# Altium schematic sheet 1V8 Buck.SchDoc
size A
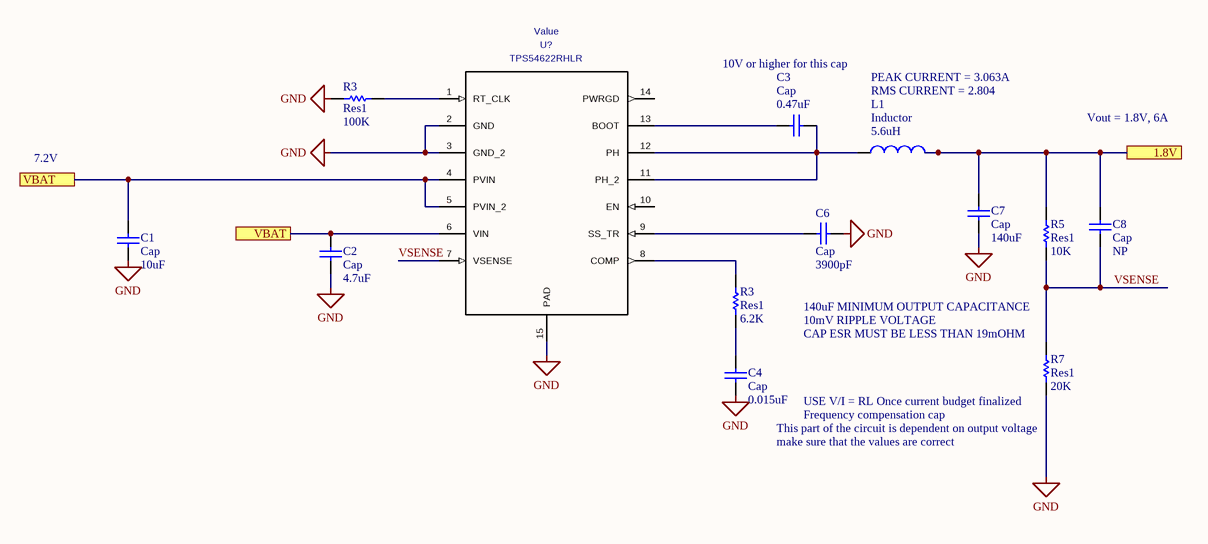
[diagram p0: 1V8 Buck.SchDoc]

## Parts
(Parts that share a designator on the sheet are numbered #1, #2 ... from top to bottom, then left to right.)
C1  Cap  value 10uF  [RAD-0.3]
C2  Cap  value 4.7uF  [RAD-0.3]
C3  Cap  value 0.47uF  [RAD-0.3]
C4  Cap  value 0.015uF  [RAD-0.3]
C6  Cap  value 3900pF  [RAD-0.3]
C7  Cap  value 140uF  [RAD-0.3]
C8  Cap  value NP  [RAD-0.3]
L1  Inductor  value 5.6uH  [0402-A]
R3#1  Res1  value 100K  [AXIAL-0.3]
R3#2  Res1  value 6.2K  [AXIAL-0.3]
R5  Res1  value 10K  [AXIAL-0.3]
R7  Res1  value 20K  [AXIAL-0.3]
U?  TPS54622RHLR  [RHL0014A]

## Ports
1.8V, VBAT

## Nets
GND: C1.1 C2.1 C4.1 C6.1 C7.1 R3#1.1 R7.1 U?.2(GND) U?.3(GND_2) U?.15(PAD)
1.8V: C7.2 C8.2 L1.2 R5.1 ; port 1.8V
VBAT: C1.2 C2.2 U?.4(PVIN) U?.5(PVIN_2) U?.6(VIN) ; port VBAT
VSENSE: C8.1 R5.2 R7.2 U?.7(VSENSE)
NetC3_1: C3.1 U?.13(BOOT)
NetC3_2: C3.2 L1.1 U?.11(PH_2) U?.12(PH)
NetC4_2: C4.2 R3#2.1
NetC6_2: C6.2 U?.9(SS_TR)
NetR3#1_2: R3#1.2 U?.1(RT_CLK)
NetR3#2_2: R3#2.2 U?.8(COMP)

Not connected (* = marked no-connect by the designer): U? 10(EN) 14(PWRGD)

## Notes on the sheet
- 10V or higher for this cap
- PEAK CURRENT = 3.063A
- RMS CURRENT = 2.804
- Vout = 1.8V, 6A
- 7.2V
- 140uF MINIMUM OUTPUT CAPACITANCE
- 10mV RIPPLE VOLTAGE
- CAP ESR MUST BE LESS THAN 19mOHM
- (near R7) USE V/I = RL Once current budget finalized
- Frequency compensation cap
- This part of the circuit is dependent on output voltage
- make sure that the values are correct

## Library data of the parts
C1-C4 C6-C8 = Cap: Capacitor; Published: 8-Jun-2000; LatestRevisionDate: 17-Jul-2002; LatestRevisionNote: Re-released for DXP Platform.; PackageReference: RAD-0.3; Publisher: Altium Limited; PackageDescription: Radial Cap, Thru-Hole; 2 Leads; 0.3 in Pin Spacing
L1 = Inductor: Code_IEC: 1005; Published: 8-Jun-2000; LatestRevisionDate: 29-May-2009; LatestRevisionNote: IPC-7351 Footprint Added.; PackageReference: 0402-A; Publisher: Altium Limited; PackageDescription: Chip Inductor; Code_JEITA: 0402
R3#1 R3#2 R5 R7 = Res1: Resistor; Published: 8-Jun-2000; LatestRevisionDate: 17-Jul-2002; LatestRevisionNote: Re-released for DXP Platform.; PackageReference: AXIAL-0.3; Publisher: Altium Limited; PackageDescription: Axial Device, Thru-Hole; 2 Leads; 0.3 in Pin Spacing
U? = TPS54622RHLR: Manufacturer: Texas Instruments; CompType: IC; PIN_COUNT: 15; PartNumber: TPS54622RHLR; PackageReference: RHL0014A; MountType: SMT; RoHS: Y; Value: Value